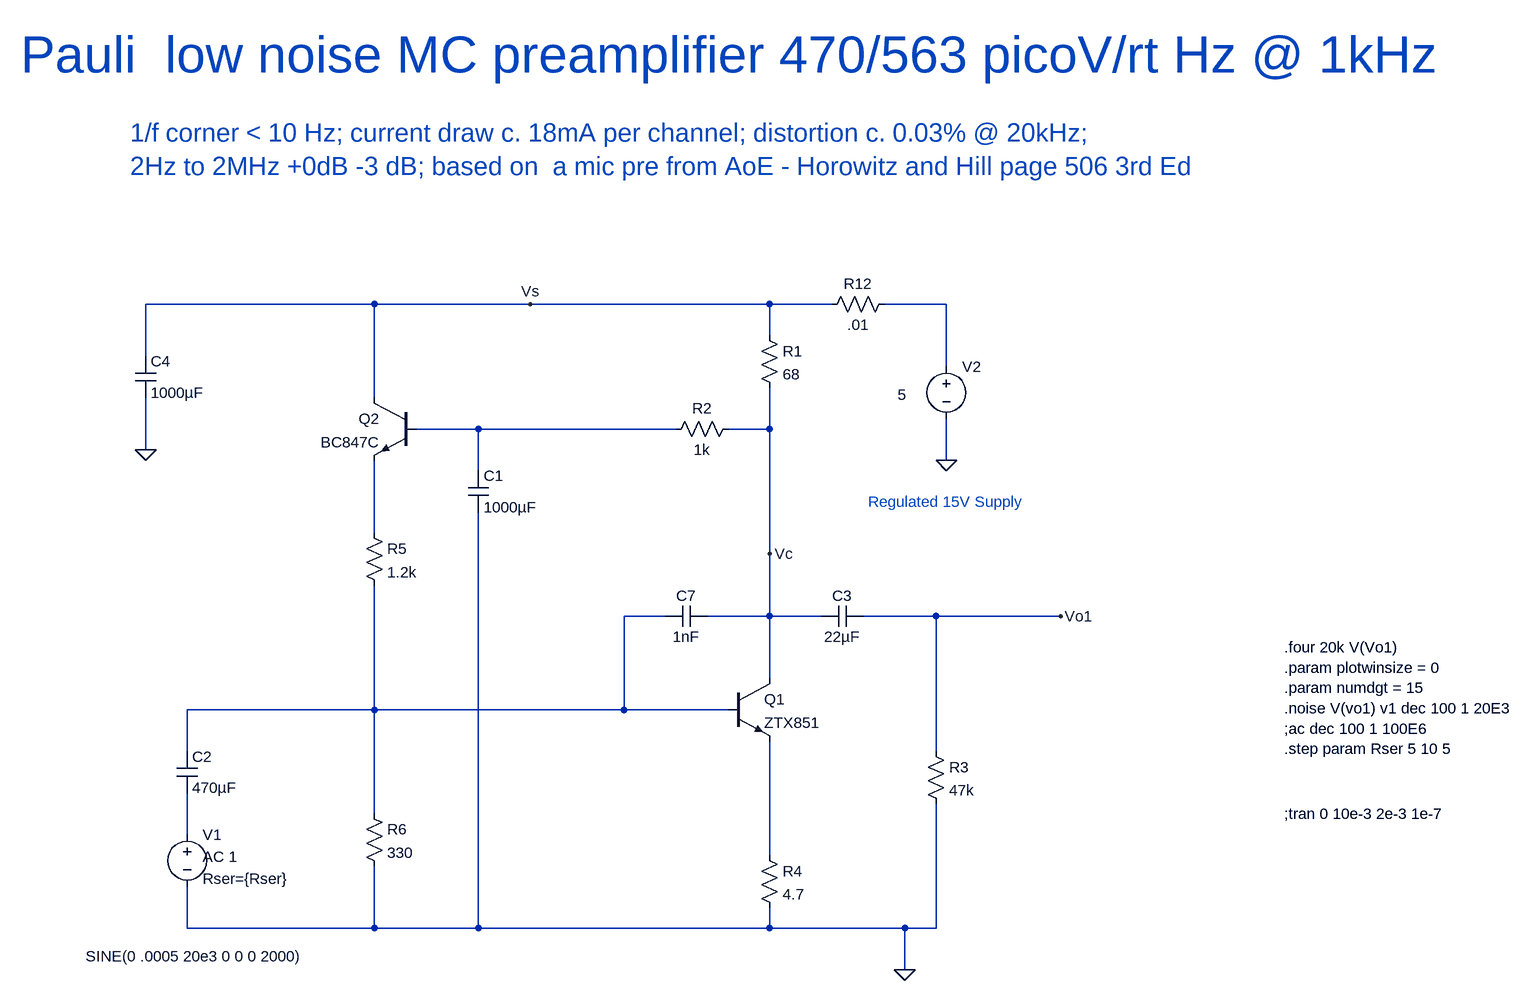
[diagram p0: schematic Pauli.asc]
Pauli.asc, the LTspice schematic file:
Version 4
SHEET 1 1520 1304
WIRE -2000 -112 -2352 -112
WIRE -1760 -112 -2000 -112
WIRE -1392 -112 -1760 -112
WIRE -1296 -112 -1392 -112
WIRE -1120 -112 -1216 -112
WIRE -1392 -64 -1392 -112
WIRE -2352 -32 -2352 -112
WIRE -1120 -16 -1120 -112
WIRE -2000 32 -2000 -112
WIRE -1840 80 -1936 80
WIRE -1536 80 -1840 80
WIRE -1392 80 -1392 16
WIRE -1392 80 -1456 80
WIRE -2352 112 -2352 32
WIRE -1120 128 -1120 64
WIRE -1840 144 -1840 80
WIRE -2000 240 -2000 128
WIRE -1392 272 -1392 80
WIRE -1552 368 -1616 368
WIRE -1392 368 -1392 272
WIRE -1392 368 -1488 368
WIRE -1312 368 -1392 368
WIRE -1136 368 -1248 368
WIRE -944 368 -1136 368
WIRE -1392 464 -1392 368
WIRE -2000 512 -2000 320
WIRE -2000 512 -2288 512
WIRE -1616 512 -1616 368
WIRE -1616 512 -2000 512
WIRE -1456 512 -1616 512
WIRE -2288 576 -2288 512
WIRE -1136 576 -1136 368
WIRE -2000 672 -2000 512
WIRE -2288 704 -2288 640
WIRE -1392 736 -1392 560
WIRE -2288 848 -2288 784
WIRE -2000 848 -2000 752
WIRE -2000 848 -2288 848
WIRE -1840 848 -1840 208
WIRE -1840 848 -2000 848
WIRE -1392 848 -1392 816
WIRE -1392 848 -1840 848
WIRE -1184 848 -1392 848
WIRE -1136 848 -1136 656
WIRE -1136 848 -1184 848
WIRE -1184 912 -1184 848
FLAG -1120 128 0
FLAG -1184 912 0
FLAG -944 368 Vo1
FLAG -1392 272 Vc
FLAG -2352 112 0
FLAG -1760 -112 Vs
SYMBOL npn -1456 464 R0
SYMATTR InstName Q1
SYMATTR Value ZTX851
SYMBOL voltage -2288 688 R0
WINDOW 3 -156 203 Left 2
WINDOW 123 24 50 Left 2
WINDOW 39 24 84 Left 2
SYMATTR Value SINE(0 .0005 20e3 0 0 0 2000)
SYMATTR Value2 AC 1
SYMATTR SpiceLine Rser={Rser}
SYMATTR InstName V1
SYMBOL cap -2304 576 R0
SYMATTR InstName C2
SYMATTR Value 470µF
SYMBOL voltage -1120 -32 R0
WINDOW 3 -75 59 Left 2
WINDOW 123 24 50 Left 2
WINDOW 39 0 0 Left 2
SYMATTR Value 5
SYMATTR InstName V2
SYMBOL cap -1248 352 R90
WINDOW 0 0 32 VBottom 2
WINDOW 3 32 32 VTop 2
SYMATTR InstName C3
SYMATTR Value 22µF
SYMBOL npn -1936 32 M0
SYMATTR InstName Q2
SYMATTR Value BC847C
SYMBOL res -1408 -80 R0
SYMATTR InstName R1
SYMATTR Value 68
SYMBOL res -2016 224 R0
SYMATTR InstName R5
SYMATTR Value 1.2k
SYMBOL res -2016 656 R0
SYMATTR InstName R6
SYMATTR Value 330
SYMBOL res -1440 64 R90
WINDOW 0 0 56 VBottom 2
WINDOW 3 32 56 VTop 2
SYMATTR InstName R2
SYMATTR Value 1k
SYMBOL cap -1856 144 R0
SYMATTR InstName C1
SYMATTR Value 1000µF
SYMBOL res -1152 560 R0
SYMATTR InstName R3
SYMATTR Value 47k
SYMBOL res -1408 720 R0
SYMATTR InstName R4
SYMATTR Value 4.7
SYMBOL cap -2368 -32 R0
SYMATTR InstName C4
SYMATTR Value 1000µF
SYMBOL res -1200 -128 R90
WINDOW 0 0 56 VBottom 2
WINDOW 3 32 56 VTop 2
SYMATTR InstName R12
SYMATTR Value .01
SYMBOL cap -1488 352 R90
WINDOW 0 0 32 VBottom 2
WINDOW 3 32 32 VTop 2
SYMATTR InstName C7
SYMATTR Value 1nF
TEXT -600 672 Left 2 !;tran 0 10e-3 2e-3 1e-7
TEXT -600 416 Left 2 !.four 20k V(Vo1)\n.param plotwinsize = 0\n.param numdgt = 15\n.noise V(vo1) v1 dec 100 1 20E3\n;ac dec 100 1 100E6\n.step param Rser 5 10 5
TEXT -2544 -496 Left 6 ;Pauli  low noise MC preamplifier 470/563 picoV/rt Hz @ 1kHz
TEXT -2376 -376 Left 4 ;1/f corner < 10 Hz; current draw c. 18mA per channel; distortion c. 0.03% @ 20kHz;\n2Hz to 2MHz +0dB -3 dB; based on  a mic pre from AoE - Horowitz and Hill page 506 3rd Ed
TEXT -1240 192 Left 2 ;Regulated 15V Supply

The netlist it stands for:
* Pauli.asc
Q1 Vc N004 N006 0 ZTX851
V1 N005 0 SINE(0 .0005 20e3 0 0 0 2000) AC 1 Rser={Rser}
C2 N004 N005 470µF
V2 N001 0 5
C3 Vo1 Vc 22µF
Q2 Vs N002 N003 0 BC847C
R1 Vs Vc 68
R5 N003 N004 1.2k
R6 N004 0 330
R2 Vc N002 1k
C1 N002 0 1000µF
R3 Vo1 0 47k
R4 N006 0 4.7
C4 Vs 0 1000µF
R12 N001 Vs .01
C7 Vc N004 1nF
.model NPN NPN
.model PNP PNP
.lib standard.bjt
;tran 0 10e-3 2e-3 1e-7
.four 20k V(Vo1)
.param plotwinsize = 0
.param numdgt = 15
.noise V(vo1) v1 dec 100 1 20E3
;ac dec 100 1 100E6
.step param Rser 5 10 5
* Pauli  low noise MC preamplifier 470/563 picoV/rt Hz @ 1kHz
* 1/f corner < 10 Hz; current draw c. 18mA per channel; distortion c. 0.03% @ 20kHz;
* 2Hz to 2MHz +0dB -3 dB; based on  a mic pre from AoE - Horowitz and Hill page 506 3rd Ed
* Regulated 15V Supply
.backanno
.end